# EAGLE design MX4-7-9 (EAGLE 7.7.0)
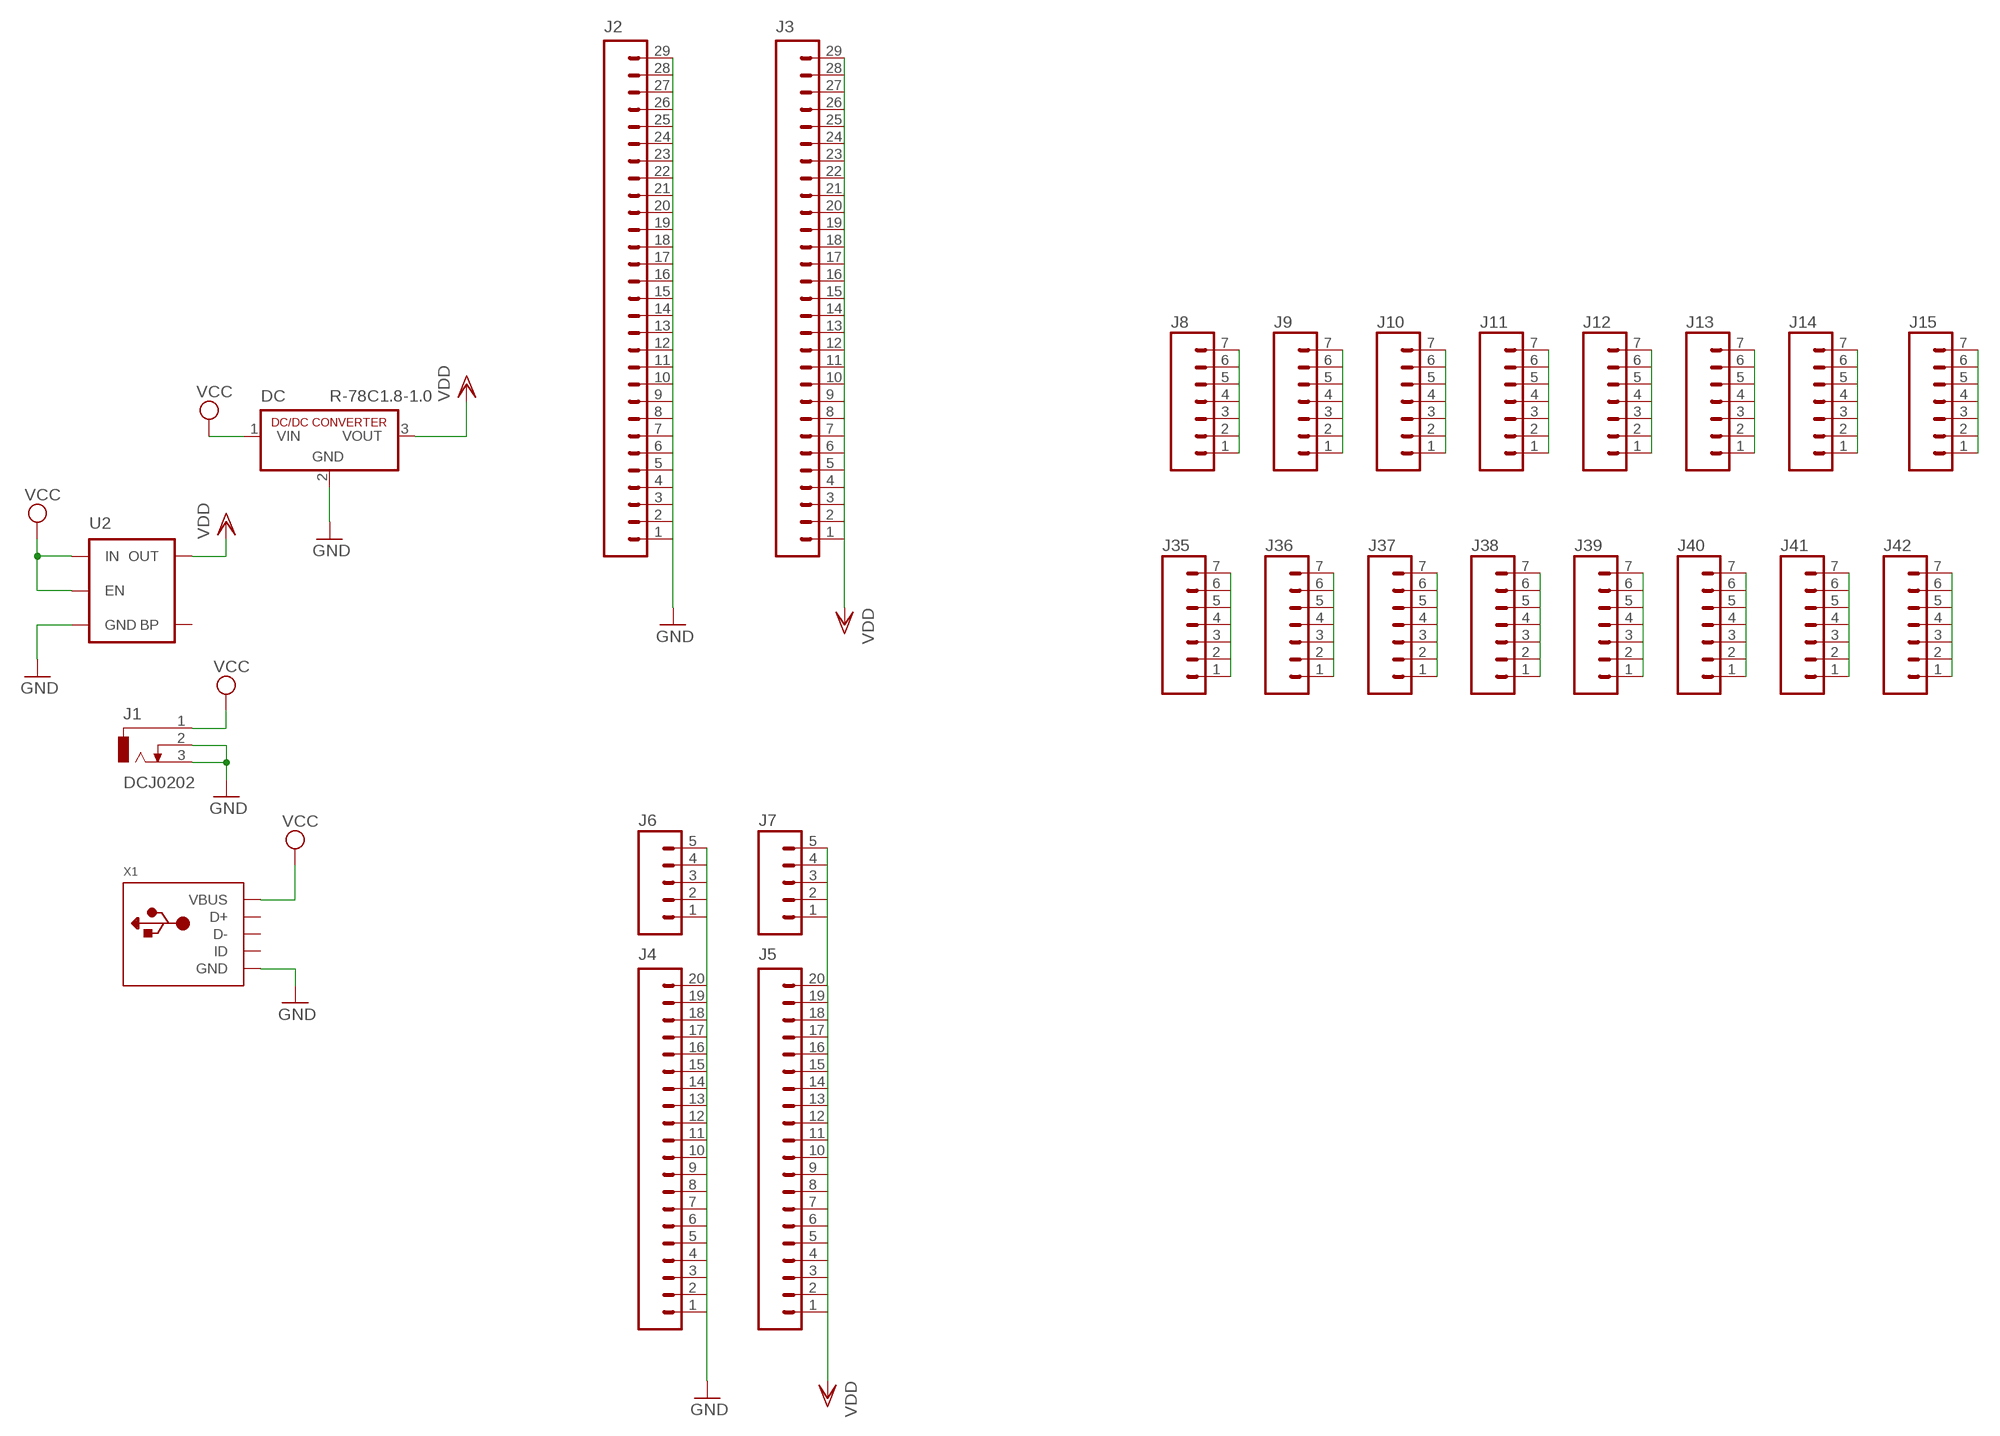
[diagram p0: schematic, sheet 1, part 1 of 2]
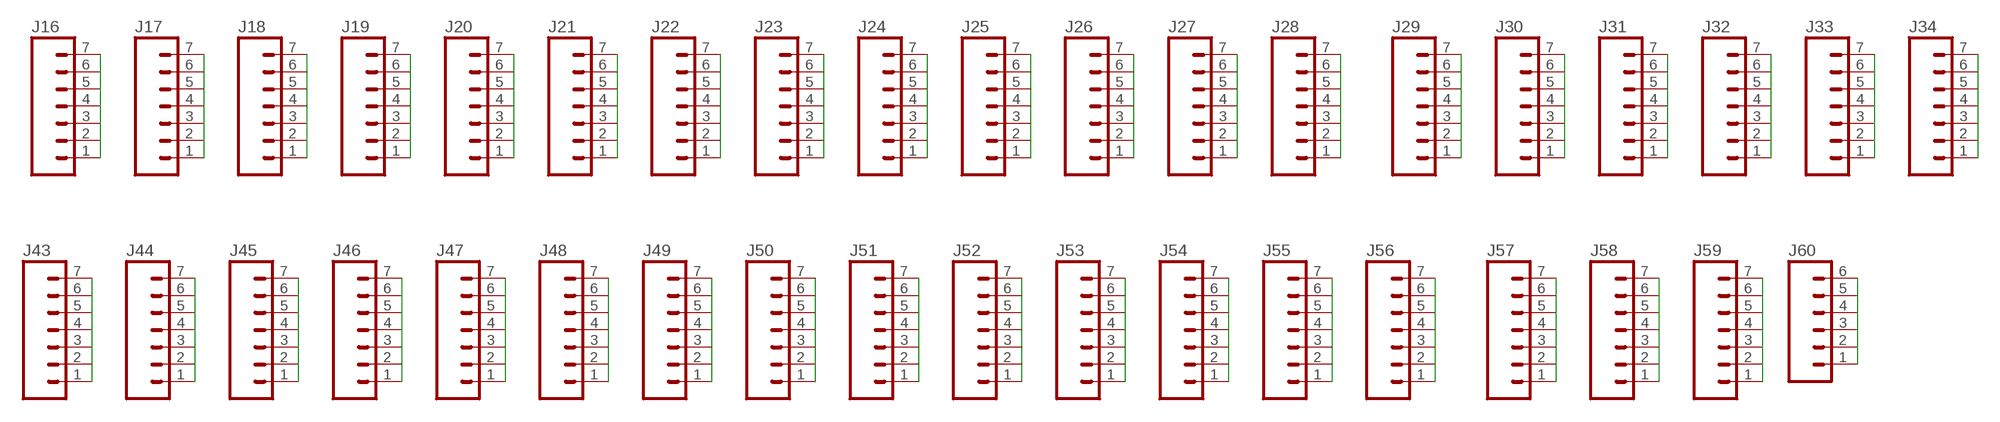
[diagram p1: schematic, sheet 1, part 2 of 2]

## Parts
DC  R-78C1.8-1.0  [SIP3]
J1  DCJ0202  [DCJ0202]
J2  M29NO_SILK  [1X29_NO_SILK]
J3  M29NO_SILK  [1X29_NO_SILK]
J4  M20NO_SILK_KIT  [1X20_NO_SILK_KIT]
J5  M20NO_SILK_KIT  [1X20_NO_SILK_KIT]
J6  M05NO_SILK  [1X05_NO_SILK]
J7  M05NO_SILK  [1X05_NO_SILK]
J8  M07NO_SILK  [1X07_NO_SILK]
J9  M07NO_SILK  [1X07_NO_SILK]
J10  M07NO_SILK  [1X07_NO_SILK]
J11  M07NO_SILK  [1X07_NO_SILK]
J12  M07NO_SILK  [1X07_NO_SILK]
J13  M07NO_SILK  [1X07_NO_SILK]
J14  M07NO_SILK  [1X07_NO_SILK]
J15  M07NO_SILK  [1X07_NO_SILK]
J16  M07NO_SILK  [1X07_NO_SILK]
J17  M07NO_SILK  [1X07_NO_SILK]
J18  M07NO_SILK  [1X07_NO_SILK]
J19  M07NO_SILK  [1X07_NO_SILK]
J20  M07NO_SILK  [1X07_NO_SILK]
J21  M07NO_SILK  [1X07_NO_SILK]
J22  M07NO_SILK  [1X07_NO_SILK]
J23  M07NO_SILK  [1X07_NO_SILK]
J24  M07NO_SILK  [1X07_NO_SILK]
J25  M07NO_SILK  [1X07_NO_SILK]
J26  M07NO_SILK  [1X07_NO_SILK]
J27  M07NO_SILK  [1X07_NO_SILK]
J28  M07NO_SILK  [1X07_NO_SILK]
J29  M07NO_SILK  [1X07_NO_SILK]
J30  M07NO_SILK  [1X07_NO_SILK]
J31  M07NO_SILK  [1X07_NO_SILK]
J32  M07NO_SILK  [1X07_NO_SILK]
J33  M07NO_SILK  [1X07_NO_SILK]
J34  M07NO_SILK  [1X07_NO_SILK]
J35  M07NO_SILK  [1X07_NO_SILK]
J36  M07NO_SILK  [1X07_NO_SILK]
J37  M07NO_SILK  [1X07_NO_SILK]
J38  M07NO_SILK  [1X07_NO_SILK]
J39  M07NO_SILK  [1X07_NO_SILK]
J40  M07NO_SILK  [1X07_NO_SILK]
J41  M07NO_SILK  [1X07_NO_SILK]
J42  M07NO_SILK  [1X07_NO_SILK]
J43  M07NO_SILK  [1X07_NO_SILK]
J44  M07NO_SILK  [1X07_NO_SILK]
J45  M07NO_SILK  [1X07_NO_SILK]
J46  M07NO_SILK  [1X07_NO_SILK]
J47  M07NO_SILK  [1X07_NO_SILK]
J48  M07NO_SILK  [1X07_NO_SILK]
J49  M07NO_SILK  [1X07_NO_SILK]
J50  M07NO_SILK  [1X07_NO_SILK]
J51  M07NO_SILK  [1X07_NO_SILK]
J52  M07NO_SILK  [1X07_NO_SILK]
J53  M07NO_SILK  [1X07_NO_SILK]
J54  M07NO_SILK  [1X07_NO_SILK]
J55  M07NO_SILK  [1X07_NO_SILK]
J56  M07NO_SILK  [1X07_NO_SILK]
J57  M07NO_SILK  [1X07_NO_SILK]
J58  M07NO_SILK  [1X07_NO_SILK]
J59  M07NO_SILK  [1X07_NO_SILK]
J60  M06NO_SILK_FEMALE_PTH  [1X06_NO_SILK]
U2  MIC52053.3V  [SOT23-5]
X1  USBMICRO_20329  [4UCONN_20329]

## Nets
GND: DC.2(GND) J1.2 J1.3 J2.1 J2.2 J2.3 J2.4 J2.5 J2.6 J2.7 J2.8 J2.9 J2.10 J2.11 J2.12 J2.13 J2.14 J2.15 J2.16 J2.17 J2.18 J2.19 J2.20 J2.21 J2.22 J2.23 J2.24 J2.25 J2.26 J2.27 J2.28 J2.29 J4.1 J4.2 J4.3 J4.4 J4.5 J4.6 J4.7 J4.8 J4.9 J4.10 J4.11 J4.12 J4.13 J4.14 J4.15 J4.16 J4.17 J4.18 J4.19 J4.20 J6.1 J6.2 J6.3 J6.4 J6.5 U2.2(GND) X1.BASE@1(GND) X1.BASE@2(GND) X1.GND X1.SPRT@1(GND) X1.SPRT@2(GND) X1.SPRT@3(GND) X1.SPRT@4(GND)
N$1: J8.1 J8.2 J8.3 J8.4 J8.5 J8.6 J8.7
N$2: J9.1 J9.2 J9.3 J9.4 J9.5 J9.6 J9.7
N$3: J10.1 J10.2 J10.3 J10.4 J10.5 J10.6 J10.7
N$4: J11.1 J11.2 J11.3 J11.4 J11.5 J11.6 J11.7
N$5: J12.1 J12.2 J12.3 J12.4 J12.5 J12.6 J12.7
N$6: J13.1 J13.2 J13.3 J13.4 J13.5 J13.6 J13.7
N$7: J14.1 J14.2 J14.3 J14.4 J14.5 J14.6 J14.7
N$8: J15.1 J15.2 J15.3 J15.4 J15.5 J15.6 J15.7
N$9: J16.1 J16.2 J16.3 J16.4 J16.5 J16.6 J16.7
N$10: J17.1 J17.2 J17.3 J17.4 J17.5 J17.6 J17.7
N$11: J18.1 J18.2 J18.3 J18.4 J18.5 J18.6 J18.7
N$12: J19.1 J19.2 J19.3 J19.4 J19.5 J19.6 J19.7
N$13: J20.1 J20.2 J20.3 J20.4 J20.5 J20.6 J20.7
N$14: J21.1 J21.2 J21.3 J21.4 J21.5 J21.6 J21.7
N$15: J22.1 J22.2 J22.3 J22.4 J22.5 J22.6 J22.7
N$16: J23.1 J23.2 J23.3 J23.4 J23.5 J23.6 J23.7
N$17: J24.1 J24.2 J24.3 J24.4 J24.5 J24.6 J24.7
N$18: J25.1 J25.2 J25.3 J25.4 J25.5 J25.6 J25.7
N$19: J26.1 J26.2 J26.3 J26.4 J26.5 J26.6 J26.7
N$20: J27.1 J27.2 J27.3 J27.4 J27.5 J27.6 J27.7
N$21: J28.1 J28.2 J28.3 J28.4 J28.5 J28.6 J28.7
N$22: J29.1 J29.2 J29.3 J29.4 J29.5 J29.6 J29.7
N$23: J30.1 J30.2 J30.3 J30.4 J30.5 J30.6 J30.7
N$24: J31.1 J31.2 J31.3 J31.4 J31.5 J31.6 J31.7
N$26: J32.1 J32.2 J32.3 J32.4 J32.5 J32.6 J32.7
N$27: J33.1 J33.2 J33.3 J33.4 J33.5 J33.6 J33.7
N$28: J34.1 J34.2 J34.3 J34.4 J34.5 J34.6 J34.7
N$29: J35.1 J35.2 J35.3 J35.4 J35.5 J35.6 J35.7
N$30: J36.1 J36.2 J36.3 J36.4 J36.5 J36.6 J36.7
N$31: J37.1 J37.2 J37.3 J37.4 J37.5 J37.6 J37.7
N$32: J38.1 J38.2 J38.3 J38.4 J38.5 J38.6 J38.7
N$33: J39.1 J39.2 J39.3 J39.4 J39.5 J39.6 J39.7
N$34: J40.1 J40.2 J40.3 J40.4 J40.5 J40.6 J40.7
N$35: J41.1 J41.2 J41.3 J41.4 J41.5 J41.6 J41.7
N$36: J42.1 J42.2 J42.3 J42.4 J42.5 J42.6 J42.7
N$37: J43.1 J43.2 J43.3 J43.4 J43.5 J43.6 J43.7
N$38: J44.1 J44.2 J44.3 J44.4 J44.5 J44.6 J44.7
N$39: J45.1 J45.2 J45.3 J45.4 J45.5 J45.6 J45.7
N$40: J46.1 J46.2 J46.3 J46.4 J46.5 J46.6 J46.7
N$41: J47.1 J47.2 J47.3 J47.4 J47.5 J47.6 J47.7
N$43: J48.1 J48.2 J48.3 J48.4 J48.5 J48.6 J48.7
N$44: J49.1 J49.2 J49.3 J49.4 J49.5 J49.6 J49.7
N$46: J50.1 J50.2 J50.3 J50.4 J50.5 J50.6 J50.7
N$47: J51.1 J51.2 J51.3 J51.4 J51.5 J51.6 J51.7
N$48: J52.1 J52.2 J52.3 J52.4 J52.5 J52.6 J52.7
N$49: J53.1 J53.2 J53.3 J53.4 J53.5 J53.6 J53.7
N$50: J54.1 J54.2 J54.3 J54.4 J54.5 J54.6 J54.7
N$51: J55.1 J55.2 J55.3 J55.4 J55.5 J55.6 J55.7
N$52: J56.1 J56.2 J56.3 J56.4 J56.5 J56.6 J56.7
N$53: J57.1 J57.2 J57.3 J57.4 J57.5 J57.6 J57.7
N$54: J58.1 J58.2 J58.3 J58.4 J58.5 J58.6 J58.7
N$55: J59.1 J59.2 J59.3 J59.4 J59.5 J59.6 J59.7
N$56: J60.1 J60.2 J60.3 J60.4 J60.5 J60.6
VCC: DC.1(VIN) J1.1 U2.1(IN) U2.3(EN) X1.VBUS
VDD: DC.3(VOUT) J3.1 J3.2 J3.3 J3.4 J3.5 J3.6 J3.7 J3.8 J3.9 J3.10 J3.11 J3.12 J3.13 J3.14 J3.15 J3.16 J3.17 J3.18 J3.19 J3.20 J3.21 J3.22 J3.23 J3.24 J3.25 J3.26 J3.27 J3.28 J3.29 J5.1 J5.2 J5.3 J5.4 J5.5 J5.6 J5.7 J5.8 J5.9 J5.10 J5.11 J5.12 J5.13 J5.14 J5.15 J5.16 J5.17 J5.18 J5.19 J5.20 J7.1 J7.2 J7.3 J7.4 J7.5 U2.5(OUT)
Unconnected: U2.4(BP) X1.D+ X1.D- X1.ID

## Library data of the parts
DC = dc-dc-converter:R-78C*-1.0: INNOLINE DC/DC-Converter 1.0 AMP SIP3 Single Output Source: Data sheet <http://www.mikrocontroller.net/attachment/150645/157764-da-01-en-DC_DC_WANDLER_R_78C5_0_1_0.pdf>
J1 = con-jack:DCJ0202: DC POWER JACK Source: DCJ0202.pdf; OC_FARNELL: unknown; OC_NEWARK: unknown
J2 J3 = SparkFun-Connectors:M29: 1x29 .1" header
J4 J5 = SparkFun-Connectors:M20: 1x20 .1" header This is just like the LOCK variant in that the holes are staggared by 5 mil, but except for the last two holes. They are not altered from the "standard" footprint layout. This is used for a special purpose on the layout of our Graphic LCD Backpack. Make sure you want to use this device before selecting it for you project!
J6 J7 = SparkFun-Connectors:M05: Header 5 Standard 5-pin 0.1" header. Use with straight break away headers (SKU : PRT-00116), right angle break away headers (PRT-00553), swiss pins (PRT-00743), machine pins (PRT-00117), and female headers (PRT-00115). Molex polarized connector foot print use with SKU : PRT-08230 with associated crimp pins and housings.
J8-J59 = SparkFun-Connectors:M07: Header 7 Standard 7-pin 0.1" header. Use with straight break away headers (SKU : PRT-00116), right angle break away headers (PRT-00553), swiss pins (PRT-00743), machine pins (PRT-00117), and female headers (PRT-00115). NOTES ON THE VARIANTS LOCK and LOCK_LONGPADS... This footprint was designed to help hold the alignment of a through-hole component (i.e. 7-pin header) while soldering it into place. You may notice that each hole has been shifted either up or down by 0.005 of an inch from it's more standard position (which is usually a perfectly straight line). This slight alteration caused the pins (the squares in the middle) to touch the edges of the holes. Because they are alternating, it causes a "brace" to hold the header in place. 0.005 has proven to be the perfect amount of "off-center" position when using our standard breakaway headers. Although looks a little odd when you look at the bare footprint, once you have a header in there, the alteration is very hard to notice. Also, if you push a header all the way into place, it is covered up entirely on the bottom side. This idea of altering the position of holes to aid alignment will be further integrated into the Sparkfun Library for other footprints. It can help hold any component with 3 or more connection pins.
J60 = SparkFun-Connectors:M06: Header 6 Standard 6-pin 0.1" header. Use with straight break away headers (SKU : PRT-00116), right angle break away headers (PRT-00553), swiss pins (PRT-00743), machine pins (PRT-00117), and female headers (PRT-00115). Molex polarized connector foot print use with SKU : PRT-08094 with associated crimp pins and housings. NOTES ON THE VARIANTS LOCK and LOCK_LONGPADS... This footprint was designed to help hold the alignment of a through-hole component (i.e. 6-pin header) while soldering it into place. You may notice that each hole has been shifted either up or down by 0.005 of an inch from it's more standard position (which is a perfectly straight line). This slight alteration caused the pins (the squares in the middle) to touch the edges of the holes. Because they are alternating, it causes a "brace" to hold the component in place. 0.005 has proven to be the perfect amount of "off-center" position when using our standard breakaway headers. Although looks a little odd when you look at the bare footprint, once you have a header in there, the alteration is very hard to notice. Also,if you push a header all the way into place, it is covered up entirely on the bottom side. This idea of altering the position of holes to aid alignment will be further integrated into the Sparkfun Library for other footprints. It can help hold any component with 3 or more connection pins.; PROD_ID: CONN-08437
U2 = SparkFun-PowerIC:MIC5205: MIC5205 150mA vreg 3.3V - VREG-00822 5V - VREG-00823; PROD_ID: VREG-00822
X1 = microbuilder:USB: USB Connectors USBMINIB - Surface Mount Female Mini-B USB Connector 4UConnector: 06564

## Net classes
0 default: width 0.508 mm, drill 0.508 mm, clearance 0.127 mm

## Board
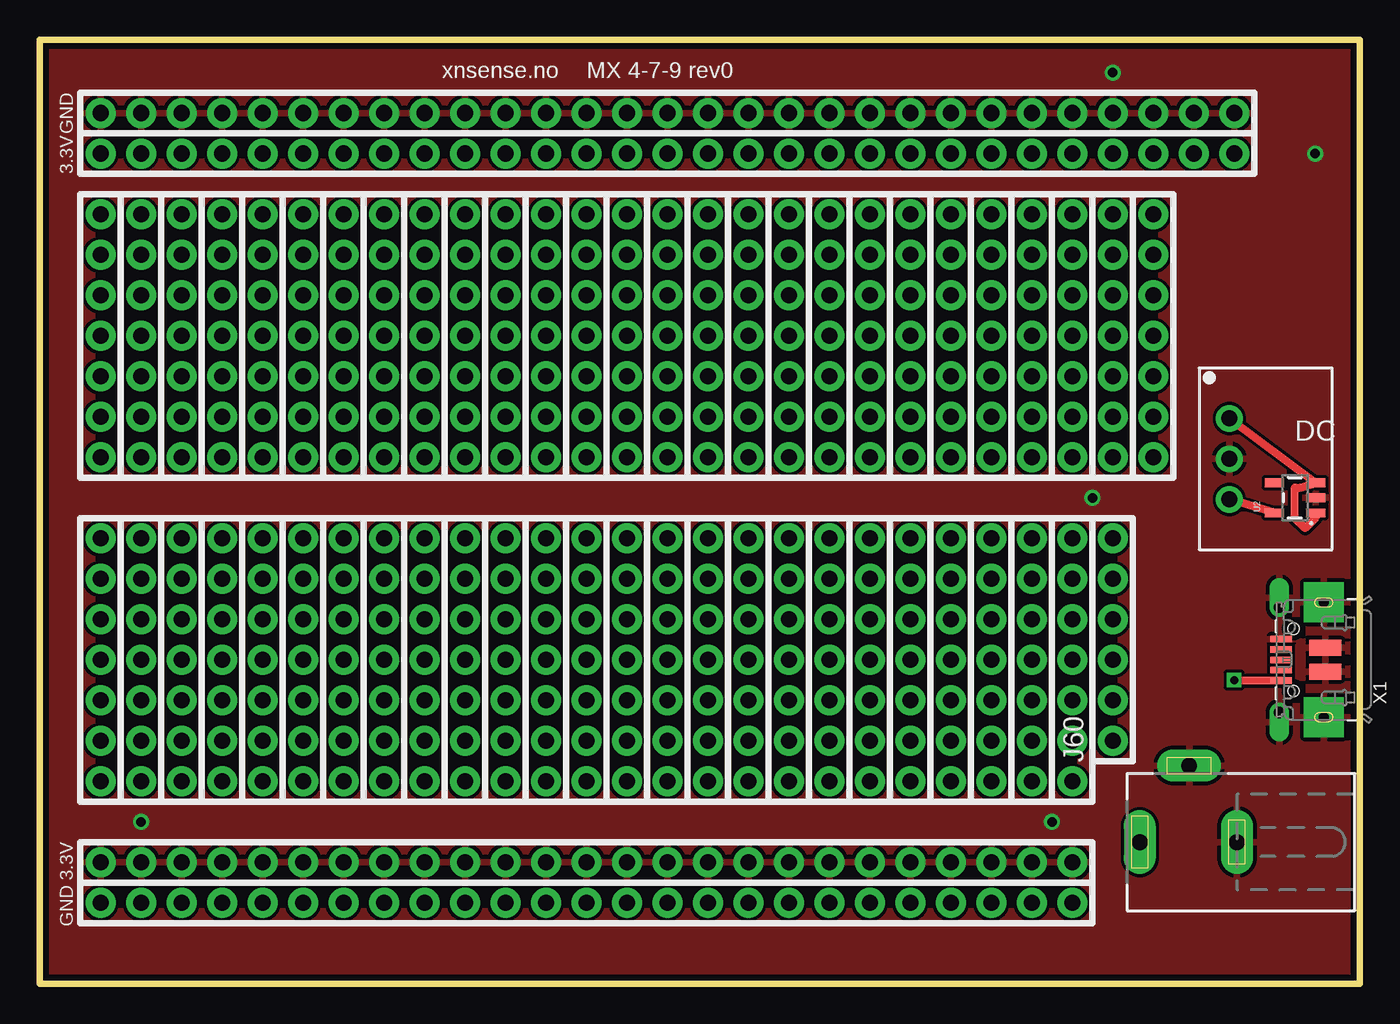
[diagram p2: board, top side]
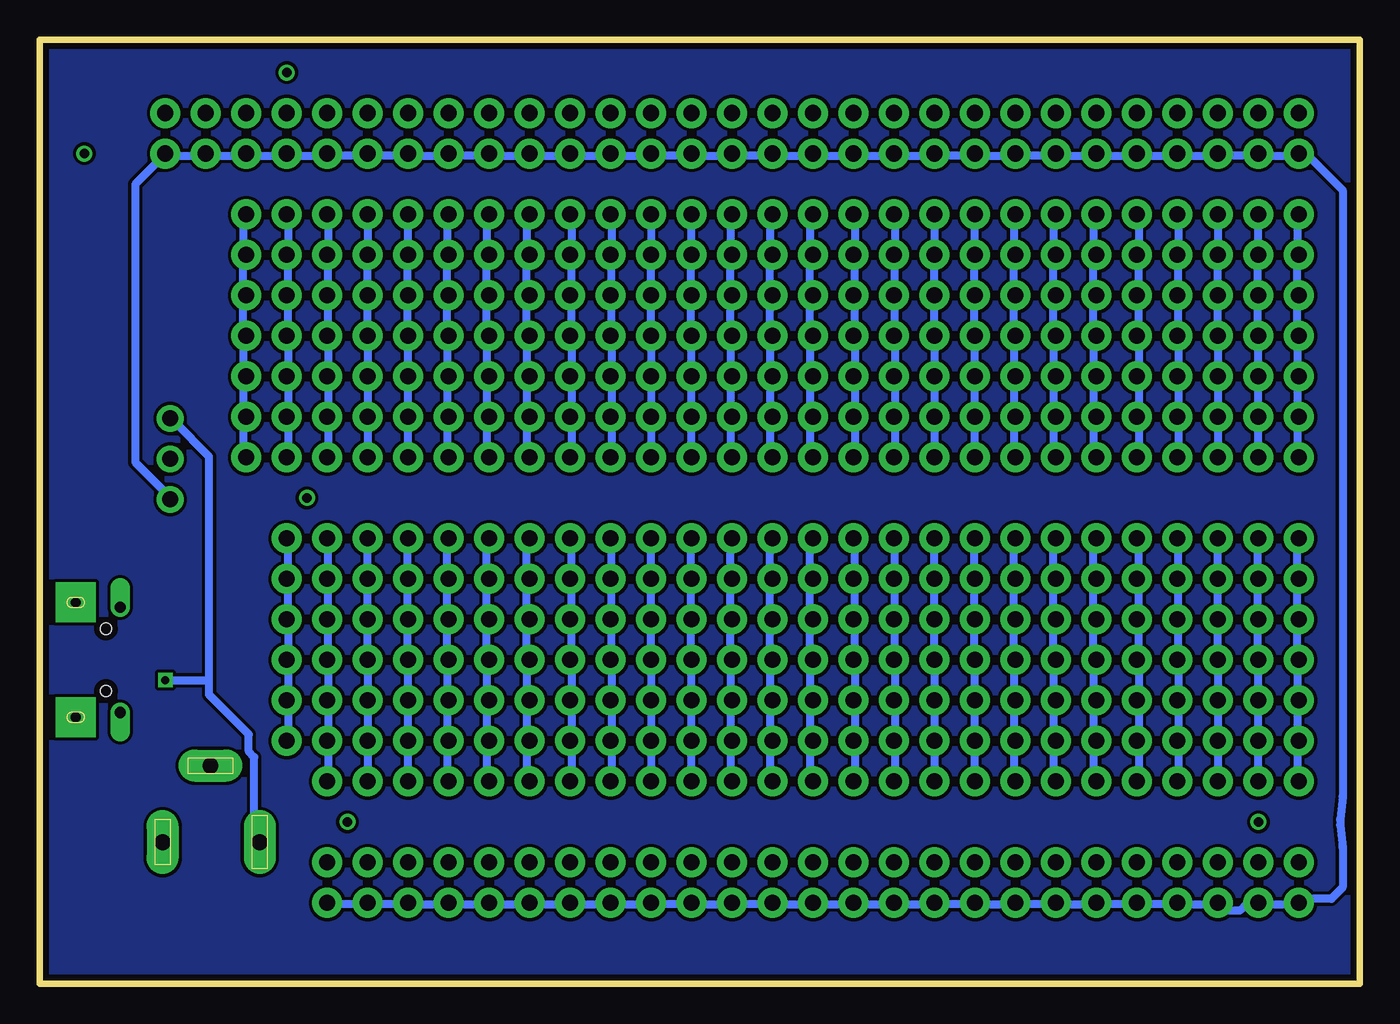
[diagram p3: board, bottom side, seen from below]

Size 82.8 x 59.2 mm. Coordinates in mm from the lower left corner, seen from the top.
Outline: 0,0 0,59.2 82.8,59.2 82.8,0 0,0
Copper layers (1*16): Top 0.035mm / dielectric 1.5mm / Bottom 0.035mm
Design rules "default *": minimum track width 10mil, minimum drill 20mil, track to track 8mil, track to pad 8mil, pad to pad 8mil, via to via 8mil, smd to smd 8mil, copper to edge 15mil, drill to drill 8mil, minimum pad ring 10mil, minimum via ring 8mil, stop-mask expansion 4mil, vias tented up to drill 0mil, thermal gap 10mil

### Footprints (pad centres in the part's own frame; a part is rotated, then mirrored left to right if it is on the bottom)
SIP3 = drill 1 pad 1.676: 1 -2.54,0; 2 0,0; 3 2.54,0
DCJ0202 = drill 1 pad 2 long: 1 0,3.1; 2 4.8,0; 3 0,-3
1X29_NO_SILK = drill 1.016 pad 1.88: 1 0,0; 2 2.54,0; 3 5.08,0; 4 7.62,0; 5 10.16,0; 6 12.7,0; 7 15.24,0; 8 17.78,0; 9 20.32,0; 10 22.86,0; 11 25.4,0; 12 27.94,0; 13 30.48,0; 14 33.02,0; 15 35.56,0; 16 38.1,0; 17 40.64,0; 18 43.18,0; 19 45.72,0; 20 48.26,0; 21 50.8,0; 22 53.34,0; 23 55.88,0; 24 58.42,0; 25 60.96,0; 26 63.5,0; 27 66.04,0; 28 68.58,0; 29 71.12,0
1X20_NO_SILK_KIT = drill 1.016 pad 1.88: 1 0,0; 2 2.54,0; 3 5.08,0; 4 7.62,0; 5 10.16,0; 6 12.7,0; 7 15.24,0; 8 17.78,0; 9 20.32,0; 10 22.86,0; 11 25.4,0; 12 27.94,0; 13 30.48,0; 14 33.02,0; 15 35.56,0; 16 38.1,0; 17 40.64,0; 18 43.18,0; 19 45.72,0; 20 48.26,0
1X05_NO_SILK = drill 1.016 pad 1.88: 1 0,0; 2 2.54,0; 3 5.08,0; 4 7.62,0; 5 10.16,0
1X07_NO_SILK = drill 1.016 pad 1.88: 1 0,0; 2 2.54,0; 3 5.08,0; 4 7.62,0; 5 10.16,0; 6 12.7,0; 7 15.24,0
1X06_NO_SILK = drill 1.016 pad 1.88: 1 0,0; 2 2.54,0; 3 5.08,0; 4 7.62,0; 5 10.16,0; 6 12.7,0
SOT23-5 = smd 0.55 x 1.2: 1 -0.95,-1.3; 2 0,-1.3; 3 0.95,-1.3; 4 0.95,1.3; 5 -0.95,1.3
4UCONN_20329 = smd 1 x 2: BASE@1 -0.75,-2; BASE@2 0.75,-2 | smd 0.4 x 1.35: D+ 0,0.775; D- -0.65,0.775; GND 1.3,0.775; ID 0.65,0.775; VBUS -1.3,0.775 | drill 0.7 offset: SPRT@1 -3.3,0.9; SPRT@2 3.3,0.9 | drill 0.6 pad 2.5 square: SPRT@3 -3.6,-1.9; SPRT@4 3.6,-1.9 | hole 0.7: -1.95,0; 1.95,0

### Placement (x,y rotation side)
DC  74.63,32.92 270 top
J1  72.1,8.89 90 top
J2  3.81,54.61 0 top
J3  3.81,52.07 0 top
J4  3.81,7.62 0 top
J5  3.81,5.08 0 top
J6  54.61,7.62 0 top
J7  54.61,5.08 0 top
J8  3.81,33.02 90 top
J9  6.35,33.02 90 top
J10  8.89,33.02 90 top
J11  11.43,33.02 90 top
J12  13.97,33.02 90 top
J13  16.51,33.02 90 top
J14  19.05,33.02 90 top
J15  21.59,33.02 90 top
J16  24.13,33.02 90 top
J17  26.67,33.02 90 top
J18  29.21,33.02 90 top
J19  31.75,33.02 90 top
J20  34.29,33.02 90 top
J21  36.83,33.02 90 top
J22  39.37,33.02 90 top
J23  41.91,33.02 90 top
J24  44.45,33.02 90 top
J25  46.99,33.02 90 top
J26  49.53,33.02 90 top
J27  52.07,33.02 90 top
J28  54.61,33.02 90 top
J29  57.15,33.02 90 top
J30  59.69,33.02 90 top
J31  62.23,33.02 90 top
J32  64.77,33.02 90 top
J33  67.31,33.02 90 top
J34  69.85,33.02 90 top
J35  3.81,12.7 90 top
J36  6.35,12.7 90 top
J37  8.89,12.7 90 top
J38  11.43,12.7 90 top
J39  13.97,12.7 90 top
J40  16.51,12.7 90 top
J41  19.05,12.7 90 top
J42  21.59,12.7 90 top
J43  24.13,12.7 90 top
J44  26.67,12.7 90 top
J45  29.21,12.7 90 top
J46  31.75,12.7 90 top
J47  34.29,12.7 90 top
J48  36.83,12.7 90 top
J49  39.37,12.7 90 top
J50  41.91,12.7 90 top
J51  44.45,12.7 90 top
J52  46.99,12.7 90 top
J53  49.53,12.7 90 top
J54  52.07,12.7 90 top
J55  54.61,12.7 90 top
J56  57.15,12.7 90 top
J57  59.69,12.7 90 top
J58  62.23,12.7 90 top
J59  64.77,12.7 90 top
J60  67.31,15.24 90 top
U2  78.74,30.48 90 top
X1  78.65,20.32 90 top

### Tracks (layer width: path | path; a pad name or v marks a point on that pad's centre or on a via)
GND  (via drill 0.6)
  other vias: 6.35,10.16 63.5,10.16 66.04,30.48 67.31,57.15 80.01,52.07
  pour Top: 0,59.2 0,0 82.8,0 82.8,59.2
N$1
  Bottom 0.508: J8.7 3.91,48.01 3.91,45.87 J8.6 3.91,45.52 3.91,43.38 J8.5 3.91,43.03 3.91,40.89 J8.4 3.91,40.54 3.91,38.41 J8.3 3.91,38.05 3.91,35.56 | 3.91,35.56 3.91,33.07 J8.1 | 3.91,35.56 J8.2
N$2
  Bottom 0.508: J9.7 6.4,48.01 6.4,45.87 J9.6 6.4,45.52 6.4,43.38 J9.5 6.4,43.03 6.4,40.89 J9.4 6.4,40.54 6.4,38.41 J9.3 6.4,38.05 6.4,35.56 | 6.4,35.56 6.4,33.07 J9.1 | 6.4,35.56 J9.2
N$3
  Bottom 0.508: J10.7 J10.6 J10.5 J10.4 J10.3 J10.2 J10.1
N$4
  Bottom 0.508: J11.7 11.38,48.01 11.38,45.87 J11.6 11.38,45.52 11.38,43.38 J11.5 11.38,43.03 11.38,40.89 J11.4 11.38,40.54 11.38,38.41 J11.3 11.38,38.05 11.38,35.56 | 11.38,35.56 11.38,33.07 J11.1 | 11.38,35.56 J11.2
N$5
  Bottom 0.508: J12.7 13.87,48.01 13.87,45.87 J12.6 13.87,45.52 13.87,43.38 J12.5 13.87,43.03 13.87,40.89 J12.4 13.87,40.54 13.87,38.41 J12.3 13.87,38.05 13.87,35.56 | 13.87,35.56 13.87,33.07 J12.1 | 13.87,35.56 J12.2
N$6
  Bottom 0.508: J13.7 16.71,48.01 16.71,45.87 J13.6 16.71,45.52 16.71,43.38 J13.5 16.71,43.03 16.71,40.89 J13.4 16.71,40.54 16.71,38.41 J13.3 16.71,38.05 16.71,35.56 | 16.71,35.56 16.71,33.07 J13.1 | 16.71,35.56 J13.2
N$7
  Bottom 0.508: J14.7 19.2,48.01 19.2,45.87 J14.6 19.2,45.52 19.2,43.38 J14.5 19.2,43.03 19.2,40.89 J14.4 19.2,40.54 19.2,38.41 J14.3 19.2,38.05 19.2,35.56 | 19.2,35.56 19.2,33.07 J14.1 | 19.2,35.56 J14.2
N$8
  Bottom 0.508: J15.7 21.69,48.01 21.69,45.87 J15.6 21.69,45.52 21.69,43.38 J15.5 21.69,43.03 21.69,40.89 J15.4 21.69,40.54 21.69,38.41 J15.3 21.69,38.05 21.69,35.56 | 21.69,35.56 21.69,33.07 J15.1 | 21.69,35.56 J15.2
N$9
  Bottom 0.508: J16.7 24.18,48.01 24.18,45.87 J16.6 24.18,45.52 24.18,43.38 J16.5 24.18,43.03 24.18,40.89 J16.4 24.18,40.54 24.18,38.41 J16.3 24.18,38.05 24.18,35.56 | 24.18,35.56 24.18,33.07 J16.1 | 24.18,35.56 J16.2
N$10
  Bottom 0.508: J17.7 J17.6 J17.5 J17.4 J17.3 J17.2 J17.1
N$11
  Bottom 0.508: J18.7 29.16,48.01 29.16,45.87 J18.6 29.16,45.52 29.16,43.38 J18.5 29.16,43.03 29.16,40.89 J18.4 29.16,40.54 29.16,38.41 J18.3 29.16,38.05 29.16,35.56 | 29.16,35.56 29.16,33.07 J18.1 | 29.16,35.56 J18.2
N$12
  Bottom 0.508: J19.7 31.65,48.01 31.65,45.87 J19.6 31.65,45.52 31.65,43.38 J19.5 31.65,43.03 31.65,40.89 J19.4 31.65,40.54 31.65,38.41 J19.3 31.65,38.05 31.65,35.56 | 31.65,35.56 31.65,33.07 J19.1 | 31.65,35.56 J19.2
N$13
  Bottom 0.508: J20.7 34.49,48.01 34.49,45.87 J20.6 34.49,45.52 34.49,43.38 J20.5 34.49,43.03 34.49,40.89 J20.4 34.49,40.54 34.49,38.41 J20.3 34.49,38.05 34.49,35.56 | 34.49,35.56 34.49,33.07 J20.1 | 34.49,35.56 J20.2
N$14
  Bottom 0.508: J21.7 36.98,48.01 36.98,45.87 J21.6 36.98,45.52 36.98,43.38 J21.5 36.98,43.03 36.98,40.89 J21.4 36.98,40.54 36.98,38.41 J21.3 36.98,38.05 36.98,35.56 | 36.98,35.56 36.98,33.07 J21.1 | 36.98,35.56 J21.2
N$15
  Bottom 0.508: J22.7 39.47,48.01 39.47,45.87 J22.6 39.47,45.52 39.47,43.38 J22.5 39.47,43.03 39.47,40.89 J22.4 39.47,40.54 39.47,38.41 J22.3 39.47,38.05 39.47,35.56 | 39.47,35.56 39.47,33.07 J22.1 | 39.47,35.56 J22.2
N$16
  Bottom 0.508: J23.7 41.96,48.01 41.96,45.87 J23.6 41.96,45.52 41.96,43.38 J23.5 41.96,43.03 41.96,40.89 J23.4 41.96,40.54 41.96,38.41 J23.3 41.96,38.05 41.96,35.56 | 41.96,35.56 41.96,33.07 J23.1 | 41.96,35.56 J23.2
N$17
  Bottom 0.508: J24.7 J24.6 J24.5 J24.4 J24.3 J24.2 J24.1
N$18
  Bottom 0.508: J25.7 46.94,48.01 46.94,45.87 J25.6 46.94,45.52 46.94,43.38 J25.5 46.94,43.03 46.94,40.89 J25.4 46.94,40.54 46.94,38.41 J25.3 46.94,38.05 46.94,35.56 | 46.94,35.56 46.94,33.07 J25.1 | 46.94,35.56 J25.2
N$19
  Bottom 0.508: J26.7 49.43,48.01 49.43,45.87 J26.6 49.43,45.52 49.43,43.38 J26.5 49.43,43.03 49.43,40.89 J26.4 49.43,40.54 49.43,38.41 J26.3 49.43,38.05 49.43,35.56 | 49.43,35.56 49.43,33.07 J26.1 | 49.43,35.56 J26.2
N$20
  Bottom 0.508: J27.7 52.27,48.01 52.27,45.87 J27.6 52.27,45.52 52.27,43.38 J27.5 52.27,43.03 52.27,40.89 J27.4 52.27,40.54 52.27,38.41 J27.3 52.27,38.05 52.27,35.56 | 52.27,35.56 52.27,33.07 J27.1 | 52.27,35.56 J27.2
N$21
  Bottom 0.508: J28.7 54.76,48.01 54.76,45.87 J28.6 54.76,45.52 54.76,43.38 J28.5 54.76,43.03 54.76,40.89 J28.4 54.76,40.54 54.76,38.41 J28.3 54.76,38.05 54.76,35.56 | 54.76,35.56 54.76,33.07 J28.1 | 54.76,35.56 J28.2
N$22
  Bottom 0.508: J29.7 57.25,48.01 57.25,45.87 J29.6 57.25,45.52 57.25,43.38 J29.5 57.25,43.03 57.25,40.89 J29.4 57.25,40.54 57.25,38.41 J29.3 57.25,38.05 57.25,35.56 | 57.25,35.56 57.25,33.07 J29.1 | 57.25,35.56 J29.2
N$23
  Bottom 0.508: J30.7 59.74,48.01 59.74,45.87 J30.6 59.74,45.52 59.74,43.38 J30.5 59.74,43.03 59.74,40.89 J30.4 59.74,40.54 59.74,38.41 J30.3 59.74,38.05 59.74,35.56 | 59.74,35.56 59.74,33.07 J30.1 | 59.74,35.56 J30.2
N$24
  Bottom 0.508: J31.7 J31.6 J31.5 J31.4 J31.3 J31.2 J31.1
N$26
  Bottom 0.508: J32.7 64.72,48.01 64.72,45.87 J32.6 64.72,45.52 64.72,43.38 J32.5 64.72,43.03 64.72,40.89 J32.4 64.72,40.54 64.72,38.41 J32.3 64.72,38.05 64.72,35.56 | 64.72,35.56 64.72,33.07 J32.1 | 64.72,35.56 J32.2
N$27
  Bottom 0.508: J33.7 67.21,48.01 67.21,45.87 J33.6 67.21,45.52 67.21,43.38 J33.5 67.21,43.03 67.21,40.89 J33.4 67.21,40.54 67.21,38.41 J33.3 67.21,38.05 67.21,35.56 | 67.21,35.56 67.21,33.07 J33.1 | 67.21,35.56 J33.2
N$28
  Bottom 0.508: J34.7 70.05,48.01 70.05,45.87 J34.6 70.05,45.52 70.05,43.38 J34.5 70.05,43.03 70.05,40.89 J34.4 70.05,40.54 70.05,38.41 J34.3 70.05,38.05 70.05,35.56 | 70.05,35.56 70.05,33.07 J34.1 | 70.05,35.56 J34.2
N$29
  Bottom 0.508: J35.1 3.91,12.8 3.91,14.94 J35.2 3.91,15.29 3.91,17.78 | 3.91,17.78 3.91,20.27 J35.4 3.91,20.62 3.91,22.76 J35.5 3.91,23.11 3.91,25.25 J35.6 3.91,25.6 3.91,27.74 J35.7 | 3.91,17.78 J35.3
N$30
  Bottom 0.508: J36.1 6.4,12.8 6.4,14.94 J36.2 6.4,15.29 6.4,17.78 | 6.4,17.78 6.4,20.27 J36.4 6.4,20.62 6.4,22.76 J36.5 6.4,23.11 6.4,25.25 J36.6 6.4,25.6 6.4,27.74 J36.7 | 6.4,17.78 J36.3
N$31
  Bottom 0.508: J37.1 J37.2 J37.3 J37.4 J37.5 J37.6 J37.7
N$32
  Bottom 0.508: J38.1 11.38,12.8 11.38,14.94 J38.2 11.38,15.29 11.38,17.78 | 11.38,17.78 11.38,20.27 J38.4 11.38,20.62 11.38,22.76 J38.5 11.38,23.11 11.38,25.25 J38.6 11.38,25.6 11.38,27.74 J38.7 | 11.38,17.78 J38.3
N$33
  Bottom 0.508: J39.1 13.87,12.8 13.87,14.94 J39.2 13.87,15.29 13.87,17.78 | 13.87,17.78 13.87,20.27 J39.4 13.87,20.62 13.87,22.76 J39.5 13.87,23.11 13.87,25.25 J39.6 13.87,25.6 13.87,27.74 J39.7 | 13.87,17.78 J39.3
N$34
  Bottom 0.508: J40.1 16.71,12.8 16.71,14.94 J40.2 16.71,15.29 16.71,17.78 | 16.71,17.78 16.71,20.27 J40.4 16.71,20.62 16.71,22.76 J40.5 16.71,23.11 16.71,25.25 J40.6 16.71,25.6 16.71,27.74 J40.7 | 16.71,17.78 J40.3
N$35
  Bottom 0.508: J41.1 19.2,12.8 19.2,14.94 J41.2 19.2,15.29 19.2,17.78 | 19.2,17.78 19.2,20.27 J41.4 19.2,20.62 19.2,22.76 J41.5 19.2,23.11 19.2,25.25 J41.6 19.2,25.6 19.2,27.74 J41.7 | 19.2,17.78 J41.3
N$36
  Bottom 0.508: J42.1 21.69,12.8 21.69,14.94 J42.2 21.69,15.29 21.69,17.78 | 21.69,17.78 21.69,20.27 J42.4 21.69,20.62 21.69,22.76 J42.5 21.69,23.11 21.69,25.25 J42.6 21.69,25.6 21.69,27.74 J42.7 | 21.69,17.78 J42.3
N$37
  Bottom 0.508: J43.1 24.18,12.8 24.18,14.94 J43.2 24.18,15.29 24.18,17.78 | 24.18,17.78 24.18,20.27 J43.4 24.18,20.62 24.18,22.76 J43.5 24.18,23.11 24.18,25.25 J43.6 24.18,25.6 24.18,27.74 J43.7 | 24.18,17.78 J43.3
N$38
  Bottom 0.508: J44.1 J44.2 J44.3 J44.4 J44.5 J44.6 J44.7
N$39
  Bottom 0.508: J45.1 29.16,12.8 29.16,14.94 J45.2 29.16,15.29 29.16,17.78 | 29.16,17.78 29.16,20.27 J45.4 29.16,20.62 29.16,22.76 J45.5 29.16,23.11 29.16,25.25 J45.6 29.16,25.6 29.16,27.74 J45.7 | 29.16,17.78 J45.3
N$40
  Bottom 0.508: J46.1 31.65,12.8 31.65,14.94 J46.2 31.65,15.29 31.65,17.78 | 31.65,17.78 31.65,20.27 J46.4 31.65,20.62 31.65,22.76 J46.5 31.65,23.11 31.65,25.25 J46.6 31.65,25.6 31.65,27.74 J46.7 | 31.65,17.78 J46.3
N$41
  Bottom 0.508: J47.1 34.49,12.8 34.49,14.94 J47.2 34.49,15.29 34.49,17.78 | 34.49,17.78 34.49,20.27 J47.4 34.49,20.62 34.49,22.76 J47.5 34.49,23.11 34.49,25.25 J47.6 34.49,25.6 34.49,27.74 J47.7 | 34.49,17.78 J47.3
N$43
  Bottom 0.508: J48.1 36.98,12.8 36.98,14.94 J48.2 36.98,15.29 36.98,17.78 | 36.98,17.78 36.98,20.27 J48.4 36.98,20.62 36.98,22.76 J48.5 36.98,23.11 36.98,25.25 J48.6 36.98,25.6 36.98,27.74 J48.7 | 36.98,17.78 J48.3
N$44
  Bottom 0.508: J49.1 39.47,12.8 39.47,14.94 J49.2 39.47,15.29 39.47,17.78 | 39.47,17.78 39.47,20.27 J49.4 39.47,20.62 39.47,22.76 J49.5 39.47,23.11 39.47,25.25 J49.6 39.47,25.6 39.47,27.74 J49.7 | 39.47,17.78 J49.3
N$45
  pour Bottom: 0,59.2 82.8,59.2 82.8,0 0,0
N$46
  Bottom 0.508: J50.1 41.96,12.8 41.96,14.94 J50.2 41.96,15.29 41.96,17.78 | 41.96,17.78 41.96,20.27 J50.4 41.96,20.62 41.96,22.76 J50.5 41.96,23.11 41.96,25.25 J50.6 41.96,25.6 41.96,27.74 J50.7 | 41.96,17.78 J50.3
N$47
  Bottom 0.508: J51.1 J51.2 J51.3 J51.4 J51.5 J51.6 J51.7
N$48
  Bottom 0.508: J52.1 46.94,12.8 46.94,14.94 J52.2 46.94,15.29 46.94,17.78 | 46.94,17.78 46.94,20.27 J52.4 46.94,20.62 46.94,22.76 J52.5 46.94,23.11 46.94,25.25 J52.6 46.94,25.6 46.94,27.74 J52.7 | 46.94,17.78 J52.3
N$49
  Bottom 0.508: J53.1 49.43,12.8 49.43,14.94 J53.2 49.43,15.29 49.43,17.78 | 49.43,17.78 49.43,20.27 J53.4 49.43,20.62 49.43,22.76 J53.5 49.43,23.11 49.43,25.25 J53.6 49.43,25.6 49.43,27.74 J53.7 | 49.43,17.78 J53.3
N$50
  Bottom 0.508: J54.1 52.27,12.8 52.27,14.94 J54.2 52.27,15.29 52.27,17.78 | 52.27,17.78 52.27,20.27 J54.4 52.27,20.62 52.27,22.76 J54.5 52.27,23.11 52.27,25.25 J54.6 52.27,25.6 52.27,27.74 J54.7 | 52.27,17.78 J54.3
N$51
  Bottom 0.508: J55.1 54.76,12.8 54.76,14.94 J55.2 54.76,15.29 54.76,17.78 | 54.76,17.78 54.76,20.27 J55.4 54.76,20.62 54.76,22.76 J55.5 54.76,23.11 54.76,25.25 J55.6 54.76,25.6 54.76,27.74 J55.7 | 54.76,17.78 J55.3
N$52
  Bottom 0.508: J56.1 57.25,12.8 57.25,14.94 J56.2 57.25,15.29 57.25,17.78 | 57.25,17.78 57.25,20.27 J56.4 57.25,20.62 57.25,22.76 J56.5 57.25,23.11 57.25,25.25 J56.6 57.25,25.6 57.25,27.74 J56.7 | 57.25,17.78 J56.3
N$53
  Bottom 0.508: J57.1 59.74,12.8 59.74,14.94 J57.2 59.74,15.29 59.74,17.78 | 59.74,17.78 59.74,20.27 J57.4 59.74,20.62 59.74,22.76 J57.5 59.74,23.11 59.74,25.25 J57.6 59.74,25.6 59.74,27.74 J57.7 | 59.74,17.78 J57.3
N$54
  Bottom 0.508: J58.1 J58.2 J58.3 J58.4 J58.5 J58.6 J58.7
N$55
  Bottom 0.508: J59.1 64.72,12.8 64.72,14.94 J59.2 64.72,15.29 64.72,17.78 | 64.72,17.78 64.72,20.27 J59.4 64.72,20.62 64.72,22.76 J59.5 64.72,23.11 64.72,25.25 J59.6 64.72,25.6 64.72,27.74 J59.7 | 64.72,17.78 J59.3
N$56
  Bottom 0.508: 67.21,17.78 67.21,15.29 J60.1 | J60.6 67.21,27.74 67.21,25.6 J60.5 67.21,25.25 67.21,23.11 J60.4 67.21,22.76 67.21,20.62 J60.3 67.21,20.27 67.21,17.78 | 67.21,17.78 J60.2
VCC  (via drill 0.51)
  Top 0.508: DC.1 U2.3 79.09,31.11 78.74,31.11 78.74,29.21 79.38,28.57 80.04,29.24 U2.1 | X1.VBUS 74.96,19.02 v74.93,19.05
  Bottom 0.508: 72.19,19.05 72.19,18.14 69.7,15.65 69.7,14.58 69.34,14.22 69.34,8.89 J1.1 | 72.19,19.05 72.19,33.07 74.32,35.2 DC.1 | v74.93,19.05 72.19,19.05
VDD
  Top 0.508: U2.5 DC.3
  Bottom 0.508: 26.67,4.98 24.18,4.98 J5.9 23.82,4.98 21.69,4.98 J5.8 21.34,4.98 19.2,4.98 J5.7 18.85,4.98 16.71,4.98 J5.6 16.36,4.98 14.22,4.98 J5.5 13.87,4.98 11.73,4.98 J5.4 11.38,4.98 8.89,4.98 | 8.89,4.98 8.53,4.62 7.47,4.62 7.11,4.98 6.4,4.98 J5.2 6.04,4.98 3.91,4.98 J5.1 3.56,5.33 1.78,5.33 1.07,6.04 1.07,8.53 1.22,9.96 1.22,10.31 1.07,11.73 1.07,49.78 3.56,52.27 J3.1 3.91,51.92 6.04,51.92 J3.2 6.4,51.92 8.89,51.92 | 8.89,4.98 J5.3 | 44.45,4.98 41.96,4.98 J5.16 41.6,4.98 39.47,4.98 J5.15 39.12,4.98 36.98,4.98 J5.14 36.63,4.98 34.49,4.98 J5.13 34.14,4.98 32,4.98 J5.12 31.65,4.98 29.52,4.98 J5.11 29.16,4.98 26.67,4.98 | 62.23,4.98 59.74,4.98 J7.3 59.38,4.98 57.25,4.98 J7.2 56.9,4.98 54.76,4.98 J7.1 54.41,4.98 52.27,4.98 J5.20 51.92,4.98 49.78,4.98 J5.19 49.43,4.98 47.3,4.98 J5.18 46.94,4.98 44.45,4.98 | 62.23,4.98 64.72,4.98 J7.5 | 62.23,4.98 J7.4 | 44.45,4.98 J5.17 | 26.67,4.98 J5.10 | DC.3 74.68,30.58 76.81,32.72 76.81,50.14 75.03,51.92 J3.29 74.68,51.92 72.54,51.92 J3.28 72.19,51.92 70.05,51.92 J3.27 69.7,51.92 67.56,51.92 J3.26 67.21,51.92 65.08,51.92 J3.25 64.72,51.92 62.23,51.92 | 26.67,51.92 24.18,51.92 J3.9 23.82,51.92 21.69,51.92 J3.8 21.34,51.92 19.2,51.92 J3.7 18.85,51.92 16.71,51.92 J3.6 16.36,51.92 14.22,51.92 J3.5 13.87,51.92 11.73,51.92 J3.4 11.38,51.92 8.89,51.92 | 8.89,51.92 J3.3 | 44.45,51.92 41.96,51.92 J3.16 41.6,51.92 39.47,51.92 J3.15 39.12,51.92 36.98,51.92 J3.14 36.63,51.92 34.49,51.92 J3.13 34.14,51.92 32,51.92 J3.12 31.65,51.92 29.52,51.92 J3.11 29.16,51.92 26.67,51.92 | 62.23,51.92 59.74,51.92 J3.23 59.38,51.92 57.25,51.92 J3.22 56.9,51.92 54.76,51.92 J3.21 54.41,51.92 52.27,51.92 J3.20 51.92,51.92 49.78,51.92 J3.19 49.43,51.92 47.3,51.92 J3.18 46.94,51.92 44.45,51.92
  Bottom 0.508: 44.45,51.92 J3.17 | 26.67,51.92 J3.10 | 62.23,51.92 J3.24

### Text on the board
tNames: xnsense.no | MX 4-7-9 rev0 | GND | 3.3V | 3.3V | GND